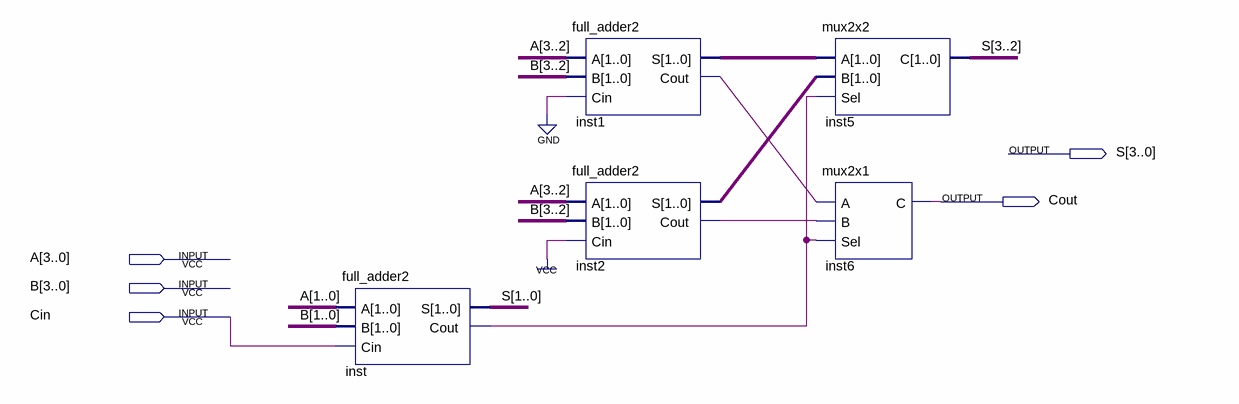
[diagram p0: schematic sheet]
// Quartus schematic full_adder4.bdf as structural Verilog: 5 symbols, 5 pins
module full_adder4 (
  input  [3:0] A,
  input  [3:0] B,
  input  Cin,
  output [3:0] S,
  output Cout
);

  wire inst1_cout, inst2_cout, inst_cout;
  wire [1:0] inst1_s, inst2_s;

  full_adder2 inst (.A(A[1:0]), .B(B[1:0]), .Cin(Cin), .S(S[1:0]), .Cout(inst_cout));
  full_adder2 inst1 (.A(A[3:2]), .B(B[3:2]), .Cin(1'b0), .S(inst1_s), .Cout(inst1_cout));
  full_adder2 inst2 (.A(A[3:2]), .B(B[3:2]), .Cin(1'b1), .S(inst2_s), .Cout(inst2_cout));
  mux2x2 inst5 (.A(inst1_s), .B(inst2_s), .Sel(inst_cout), .C(S[3:2]));
  mux2x1 inst6 (.A(inst1_cout), .B(inst2_cout), .Sel(inst_cout), .C(Cout));
endmodule
